# Altium schematic sheet sheet5_sensors.SchDoc: Proximo: Sensors
size A4; Organization: Ideetron B.V.; Address1: Dorpstraat 81; Address2: 3941 JL Doorn; Address3: 3941 JL Doorn; Address4: The Netherlands; SheetNumber: 5
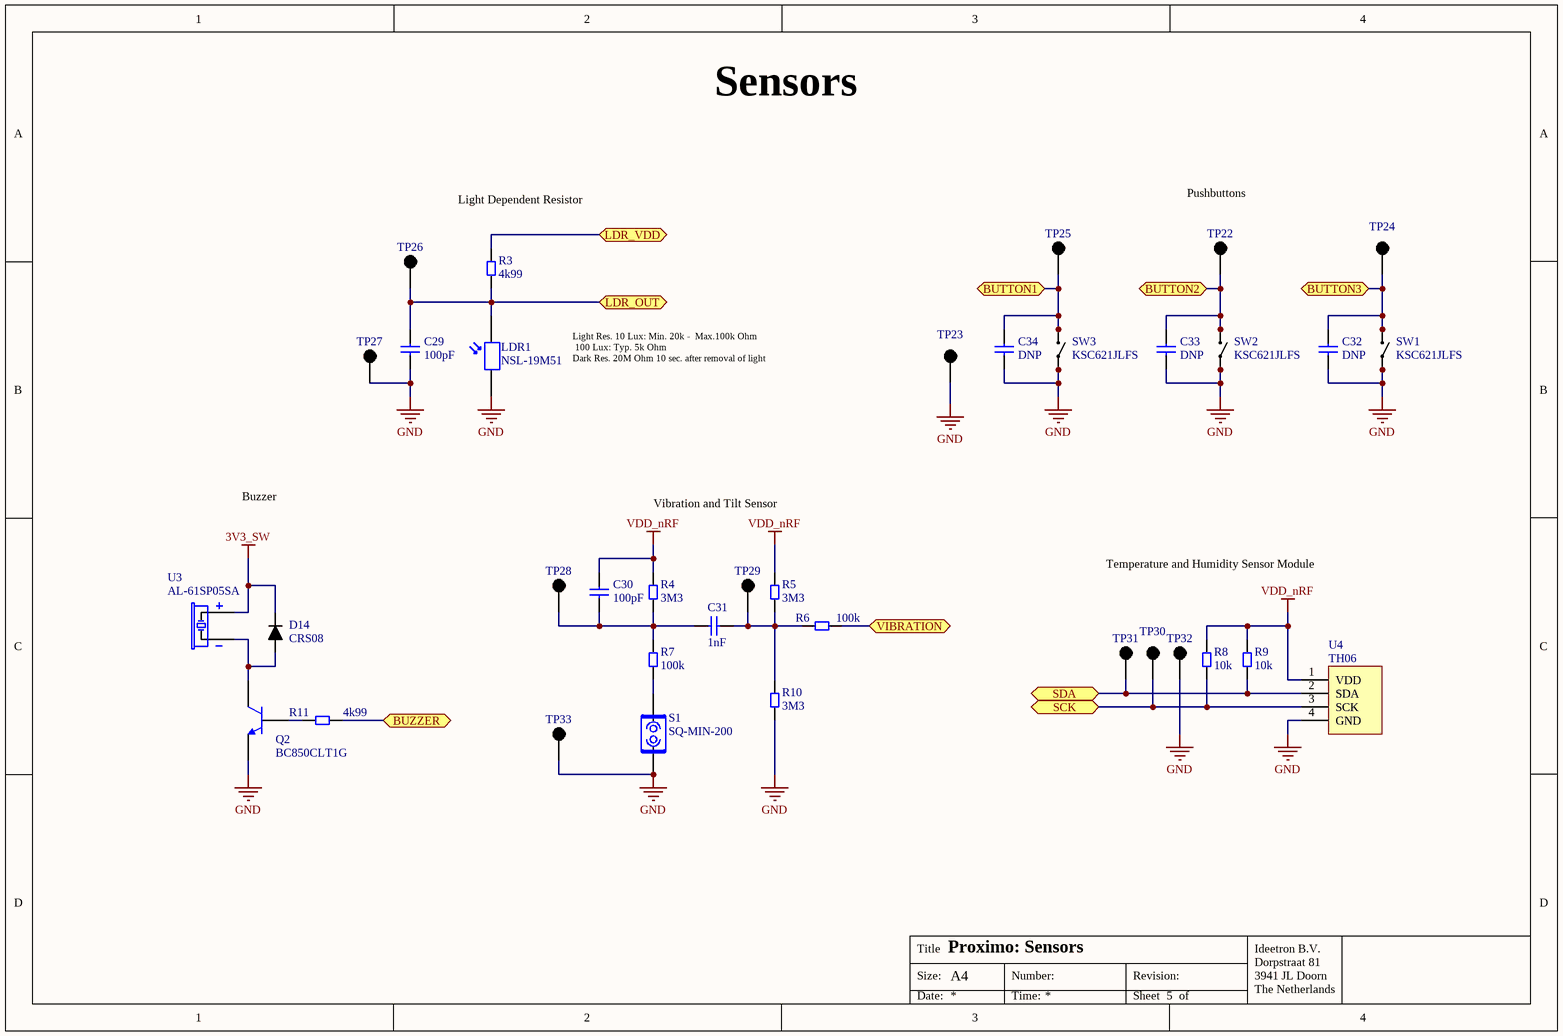
[diagram p0: sheet5_sensors.SchDoc]

## Parts
C29  100pF  [CAP0603_GCx18_MURATA]
C30  100pF  [CAP0603_GCx18_MURATA]
C31  1nF  [CAP0402_GCx18_Murata]
C32  Remark: DNP  [CAP0603_GCx18_MURATA]
C33  Remark: DNP  [CAP0603_GCx18_MURATA]
C34  Remark: DNP  [CAP0603_GCx18_MURATA]
D14  CRS08  [SOD-123F]
LDR1  NSL-19M51  [LDR]
Q2  BC850CLT1G  [SOT23]
R3  4k99  [RES0603VISHAY]
R4  3M3  [RES0603VISHAY]
R5  3M3  [RES0603VISHAY]
R6  100k  [RES0603VISHAY]
R7  100k  [RES0603VISHAY]
R8  10k  [RES0603VISHAY]
R9  10k  [RES0603VISHAY]
R10  3M3  [RES0603VISHAY]
R11  4k99  [RES0603VISHAY]
S1  SQ-MIN-200  [SQ-SEN-200]
SW1  KSC621JLFS  [KSC621JLFS]
SW2  KSC621JLFS  [KSC621JLFS]
SW3  KSC621JLFS  [KSC621JLFS]
TP22  testpad  [TestPad]  (value not drawn)  (no BOM)
TP23  testpad  [TestPad]  (value not drawn)  (no BOM)
TP24  testpad  [TestPad]  (value not drawn)  (no BOM)
TP25  testpad  [TestPad]  (value not drawn)  (no BOM)
TP26  testpad  [TestPad]  (value not drawn)  (no BOM)
TP27  testpad  [TestPad]  (value not drawn)  (no BOM)
TP28  testpad  [TestPad]  (value not drawn)  (no BOM)
TP29  testpad  [TestPad]  (value not drawn)  (no BOM)
TP30  testpad  [TestPad]  (value not drawn)  (no BOM)
TP31  testpad  [TestPad]  (value not drawn)  (no BOM)
TP32  testpad  [TestPad]  (value not drawn)  (no BOM)
TP33  testpad  [TestPad]  (value not drawn)  (no BOM)
U3  AL-61SP05SA  [Buzzer - AL-61SP05SA]
U4  TH06  [TH06_module]

## Ports
BUTTON1 (bidir), BUTTON2 (bidir), BUTTON3 (bidir), BUZZER (bidir), LDR_OUT (bidir), LDR_VDD (bidir), SCK (bidir), SDA (bidir), VIBRATION (bidir)

## Nets
3V3_SW: D14.C U3.2
GND: C29.1 C32.1 C33.1 C34.1 LDR1.1 Q2.3 R10.1 S1.1 SW1.3 SW1.4 SW2.3 SW2.4 SW3.3 SW3.4 TP23.1 TP27.1 TP32.1 TP33.1 U4.4(GND)
VDD_nRF: C30.2 R4.2 R5.2 R8.2 R9.2 U4.1(VDD)
BUTTON1: C34.2 SW3.1 SW3.2 TP25.1 ; port BUTTON1
BUTTON2: C33.2 SW2.1 SW2.2 TP22.1 ; port BUTTON2
BUTTON3: C32.2 SW1.1 SW1.2 TP24.1 ; port BUTTON3
BUZZER: R11.2 ; port BUZZER
LDR_OUT: C29.2 LDR1.2 R3.1 TP26.1 ; port LDR_OUT
LDR_VDD: R3.2 ; port LDR_VDD
SCK: R8.1 TP30.1 U4.3(SCK) ; port SCK
SDA: R9.1 TP31.1 U4.2(SDA) ; port SDA
VIBRATION: R6.1 ; port VIBRATION
NetC30_1: C30.1 C31.1 R4.1 R7.2 TP28.1
NetC31_2: C31.2 R5.1 R6.2 R10.2 TP29.1
NetD14_A: D14.A Q2.1 U3.1
NetQ2_2: Q2.2 R11.1
NetR7_1: R7.1 S1.2

## Notes on the sheet
- Sensors
- Light Dependent Resistor
- (near TP22) Pushbuttons
- Light Res. 10 Lux: Min. 20k -  Max.100k Ohm
  100 Lux: Typ. 5k Ohm
  Dark Res.	20M Ohm 10 sec. after removal of light
- Buzzer
- Vibration and Tilt Sensor
- Temperature and Humidity Sensor Module
- Title
- Size:
- A4
- Number:
- Revision:
- Date:
- Time:
- Sheet
- of

## Library data of the parts
C29 C30 = CAP_0603_100pF: Capacitor 100pF 0603 NP0; Manufacturer: Murata; Manufacturer Part Number: GCM1885C1H101JA16D; Sponsor: Nijkerk Electronics; Pin Count: 2; Value: 100pF
C31 = CAP_0402_1nF: Capacitor 1nF 0402; Manufacturer: Murata; Manufacturer Part Number: GCM188R72A102KA37D; Sponsor: Nijkerk Electronics; Pin Count: 2; Value: 1nF
C32-C34 = CAP_0603_100pF: Capacitor 100pF 0603 NP0; Pin Count: 2
D14 = CRS08 Schottky Diode: Manufacturer: Tohsiba; value: CRS08; Manufacturer Part Number: CRS08; Supplier 1: Mouser; Supplier Part Number 1: 757-CRS08(TE85R,Q,M)
LDR1 = LDR: Light Dependant Resistor Phot; Manufacturer: Luna Optoelectronics; value: NSL-19M51; Supplier 1: Farnell; Supplier 2: Digi-Key; Supplier Part Number 1: 3168335; Supplier Part Number 2: NSL-19M51-ND; Sponsor: *; Manufacturer Part Number: NSL-19M51
Q2 = BC850C: NPN general purpose transistor; Manufacturer: On Semiconductor; Manufacturer Part Number: NSVBC850CLT1G; value: BC850CLT1G; Supplier 1: Mouser; Supplier Part Number 1: 863-NSVBC850CLT1G; Sponsor: *
R3 R11 = Resistor_4k99: SMD Resistor 4k99 0603; Manufacturer: Vishay; Manufacturer Part Number: CRCW06034K99FKTABC; Sponsor: MyProto - DVC; Value: 4k99; Supplier 1: *; Supplier Part Number 1: *; Remark: *
R4 R5 R10 = Resistor_3M3: SMD Resistor 3M3 0603; Manufacturer: Vishay; Manufacturer Part Number: CRCW06033M30FKTABC; Sponsor: MyProto - DVC; Value: 3M3; Supplier 1: *; Supplier Part Number 1: *; Remark: *
R6 R7 = Resistor_100k: SMD Resistor 100k 0603; Manufacturer: Vishay; Manufacturer Part Number: CRCW0603100KFKTABC; Sponsor: MyProto - DVC; Value: 100k; Supplier 1: *; Supplier Part Number 1: *; Remark: *
R8 R9 = Resistor_10k: SMD Resistor 10k 0603; Manufacturer: Vishay; Manufacturer Part Number: CRCW060310K0FKTABC; Sponsor: MyProto - DVC; Value: 10k; Supplier 1: *; Supplier Part Number 1: *; Remark: *
S1 = SQ-MIN-200: Nano Power Tilt and Vibration sensor; Manufacturer: SignalQuest; Sponsor: Ideetron; value: SQ-MIN-200; Manufacturer Part Number: SQ-MIN-200
SW1-SW3 = KSC621JLFS Tactile switch SMT: Tactile switch SMT; Manufacturer: C & K Components; Value: KSC621JLFS; Manufacturer Part Number: KSC621JLFS; Sponsor: *; Remark: *; Supplier 1: Farnell; Supplier Part Number 1: 2320054
TP22-TP33 = TestPad: Signal probe pad; value: testpad
U3 = PiezoBuzzer: Piezo Buzzer; Manufacturer: EKULIT; Sponsor: Elincom Electronics; Value: AL-61SP05SA; Manufacturer Part Number: AL-61SP05SA
U4 = TH06: I2C Humidity and Temperature Sensor module; Manufacturer: HopeRF; Sponsor: Ideetron; value: TH06; supplier: Ideetron; Manufacturer Part Number: TH06